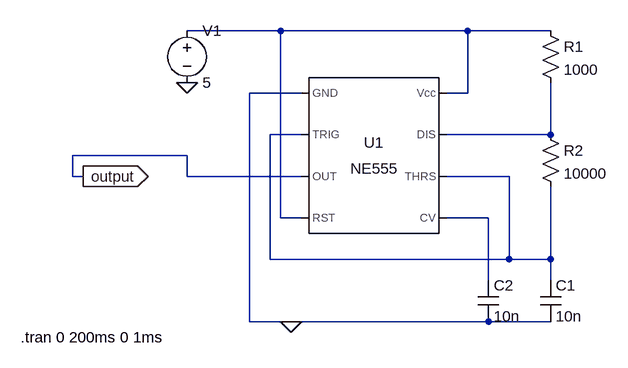
[diagram p0: schematic Draft1.asc]
Draft1.asc, the LTspice schematic file:
Version 4
SHEET 1 880 680
WIRE 112 -64 -32 -64
WIRE 400 -64 112 -64
WIRE 528 -64 400 -64
WIRE 144 32 64 32
WIRE 400 32 400 -64
WIRE 400 32 368 32
WIRE 144 96 96 96
WIRE 528 96 528 16
WIRE 528 96 368 96
WIRE -32 128 -208 128
WIRE -208 160 -208 128
WIRE -192 160 -208 160
WIRE -32 160 -32 128
WIRE 144 160 -32 160
WIRE 464 160 368 160
WIRE 112 224 112 -64
WIRE 144 224 112 224
WIRE 432 224 368 224
WIRE 96 288 96 96
WIRE 464 288 464 160
WIRE 464 288 96 288
WIRE 528 288 528 176
WIRE 528 288 464 288
WIRE 432 320 432 224
WIRE 528 320 528 288
WIRE 64 384 64 32
WIRE 128 384 64 384
WIRE 432 384 128 384
WIRE 528 384 432 384
FLAG 128 384 0
FLAG -192 160 output
IOPIN -192 160 Out
FLAG -32 16 0
SYMBOL res 512 -80 R0
SYMATTR InstName R1
SYMATTR Value 1000
SYMBOL res 512 80 R0
SYMATTR InstName R2
SYMATTR Value 10000
SYMBOL cap 512 320 R0
SYMATTR InstName C1
SYMATTR Value 10n
SYMBOL cap 416 320 R0
SYMATTR InstName C2
SYMATTR Value 10n
SYMBOL Misc\\NE555 256 128 R0
SYMATTR InstName U1
SYMBOL voltage -32 -80 R0
SYMATTR InstName V1
SYMATTR Value 5
TEXT -288 408 Left 2 !.tran 0 200ms 0 1ms

The netlist it stands for:
* Draft1.asc
R1 N001 N003 1000
R2 N003 N002 10000
C1 N002 0 10n
C2 N004 0 10n
XU1 0 N002 output N001 N004 N002 N003 N001 NE555  ; pins GND TRIG OUT RST CV THRS DIS Vcc
V1 N001 0 5
.tran 0 200ms 0 1ms
.lib NE555.sub
.backanno
.end